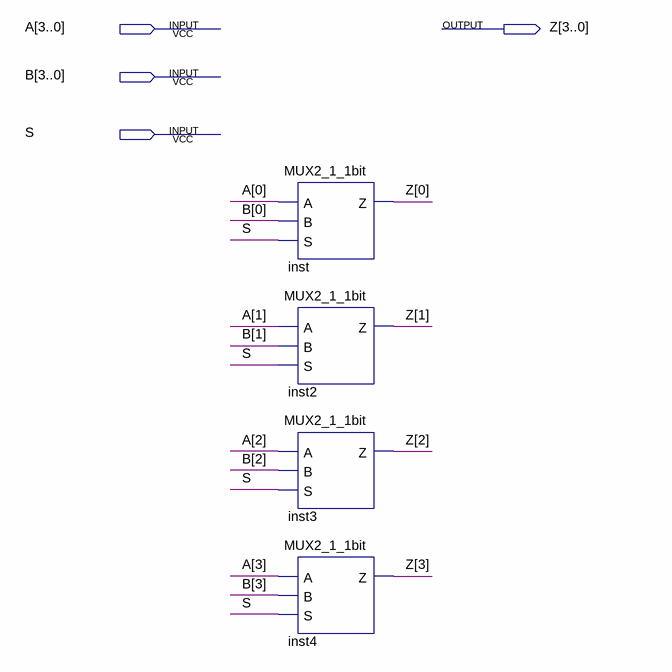
[diagram p0: schematic sheet]
// Quartus schematic MUX2_1_4bits.bdf as structural Verilog: 4 symbols, 4 pins
module MUX2_1_4bits (
  input  [3:0] A,
  input  [3:0] B,
  input  S,
  output [3:0] Z
);

  MUX2_1_1bit inst (.A(A[0]), .B(B[0]), .S(S), .Z(Z[0]));
  MUX2_1_1bit inst2 (.A(A[1]), .B(B[1]), .S(S), .Z(Z[1]));
  MUX2_1_1bit inst3 (.A(A[2]), .B(B[2]), .S(S), .Z(Z[2]));
  MUX2_1_1bit inst4 (.A(A[3]), .B(B[3]), .S(S), .Z(Z[3]));
endmodule
